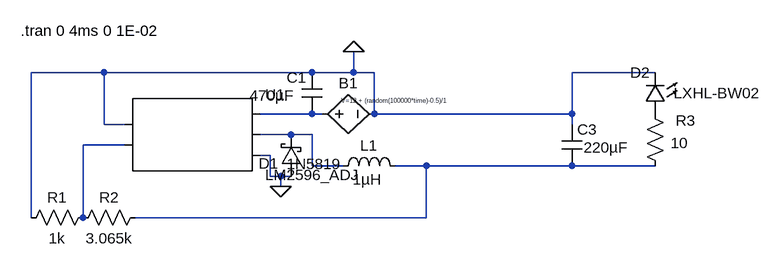
[diagram p0: schematic lm2596_adj.asc]
lm2596_adj.asc, the LTspice schematic file:
Version 4
SHEET 1 1140 680
WIRE 128 -160 16 -160
WIRE 448 -160 128 -160
WIRE 512 -160 512 -192
WIRE 512 -160 448 -160
WIRE 544 -160 512 -160
WIRE 976 -160 848 -160
WIRE 448 -96 368 -96
WIRE 464 -96 448 -96
WIRE 544 -96 544 -160
WIRE 848 -96 848 -160
WIRE 848 -96 544 -96
WIRE 128 -80 128 -160
WIRE 160 -80 128 -80
WIRE 848 -80 848 -96
WIRE 416 -64 368 -64
WIRE 448 -64 416 -64
WIRE 160 -48 96 -48
WIRE 384 -32 368 -32
WIRE 448 -16 448 -64
WIRE 496 -16 448 -16
WIRE 624 -16 576 -16
WIRE 848 -16 624 -16
WIRE 976 -16 848 -16
WIRE 384 0 384 -32
WIRE 400 0 384 0
WIRE 416 0 400 0
WIRE 400 16 400 0
WIRE 16 64 16 -160
WIRE 96 64 96 -48
WIRE 624 64 624 -16
WIRE 624 64 176 64
FLAG 512 -192 0
FLAG 400 16 0
SYMBOL cap 464 -96 R180
WINDOW 0 24 56 Left 2
WINDOW 3 43 28 Left 2
SYMATTR InstName C1
SYMATTR Value 470µF
SYMATTR SpiceLine V=50V
SYMBOL ind 480 0 R270
WINDOW 0 32 56 VTop 2
WINDOW 3 11 53 VBottom 2
SYMATTR InstName L1
SYMATTR Value 1µH
SYMBOL schottky 432 0 R180
WINDOW 0 35 20 Left 2
WINDOW 3 -62 19 Left 2
SYMATTR InstName D1
SYMATTR Value 1N5819
SYMBOL LED 992 -96 R180
WINDOW 0 24 64 Left 2
WINDOW 3 -146 32 Left 2
SYMATTR InstName D2
SYMATTR Value LXHL-BW02
SYMBOL res 992 0 R180
WINDOW 0 -46 86 Left 2
WINDOW 3 -35 51 Left 2
SYMATTR InstName R3
SYMATTR Value 10
SYMATTR SpiceLine tol=1 pwr=2
SYMBOL AutoGenerated\\LM2596_ADJ 256 -64 R0
SYMATTR InstName U1
SYMBOL res 112 48 R90
WINDOW 0 0 56 VBottom 2
WINDOW 3 32 56 VTop 2
SYMATTR InstName R1
SYMATTR Value 1k
SYMBOL res 192 48 R90
WINDOW 0 0 56 VBottom 2
WINDOW 3 32 56 VTop 2
SYMATTR InstName R2
SYMATTR Value 3.065k
SYMBOL bv 448 -96 R270
WINDOW 0 32 56 VTop 2
WINDOW 3 27 128 VBottom 0
SYMATTR InstName B1
SYMATTR Value V=12 + (random(100000*time)-0.5)/1
SYMBOL cap 832 -80 R0
WINDOW 3 34 36 Left 2
SYMATTR Value 220µF
SYMATTR InstName C3
TEXT 0 -224 Left 2 !.tran 0 4ms 0 1E-02

The netlist it stands for:
* lm2596_adj.asc
C1 N001 0 470µF V=50V
L1 N002 N004 1µH
D1 0 N002 1N5819
D2 P001 0 LXHL-BW02
R3 N004 P001 10 tol=1 pwr=2
* U1: LM2596_ADJ (symbol AutoGenerated\LM2596_ADJ not available, pins judged from their places): pin1=0 pin2=N003 pin3=N001 pin4=N002 pin5=0
R1 N003 0 1k
R2 N004 N003 3.065k
B1 N001 0 V=12 + (random(100000*time)-0.5)/1
C3 0 N004 220µF
.model D D
.lib standard.dio
.tran 0 4ms 0 1E-02
.backanno
.end